# Altium schematic sheet Connector_Sheet.SchDoc
size 420 x 297 mm; SheetNumber: 8; SheetTotal: 32
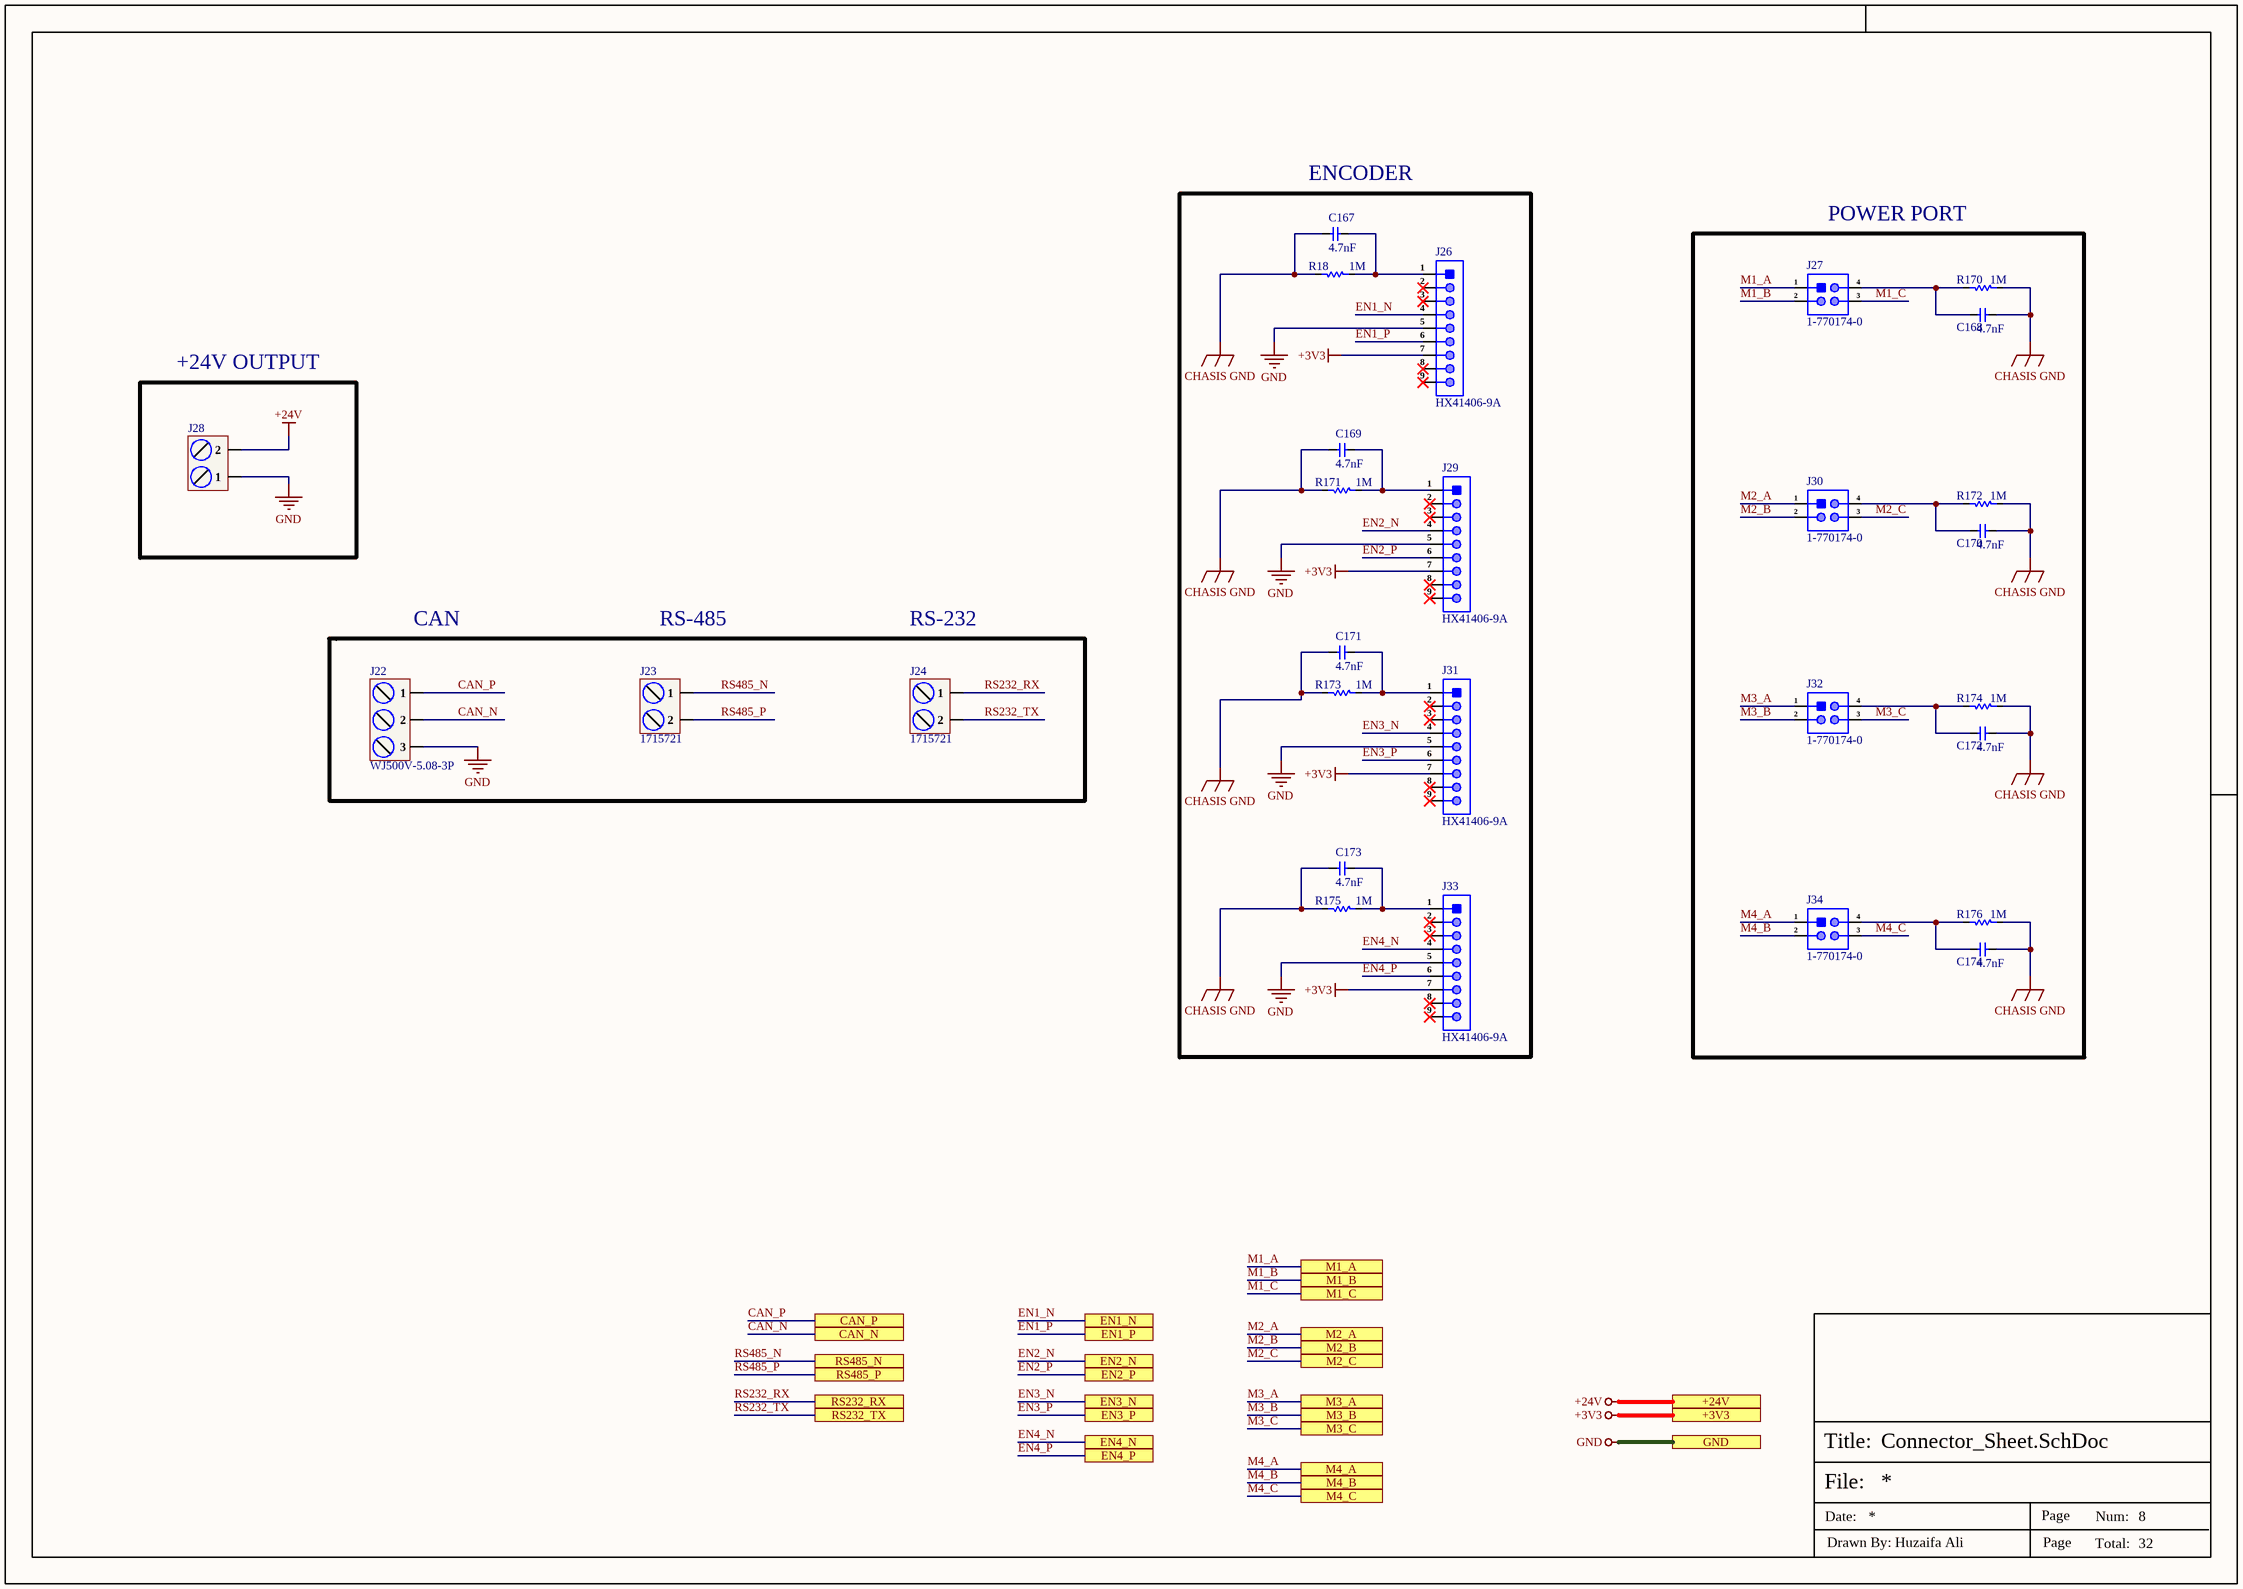
[diagram p0: Connector_Sheet.SchDoc]

## Parts
C167  4.7nF  [Cap-0603]
C168  4.7nF  [Cap-0603]
C169  4.7nF  [Cap-0603]
C170  4.7nF  [Cap-0603]
C171  4.7nF  [Cap-0603]
C172  4.7nF  [Cap-0603]
C173  4.7nF  [Cap-0603]
C174  4.7nF  [Cap-0603]
J22  WJ500V-5.08-3P  [WJ500V-5.08-3P]
J23  1715721  [1715721]
J24  1715721  [1715721]
J26  HX41406-9A  [HX41406-9A]
J27  1-770174-0  [1-770174-0]
J28  MXHB9500-9.5-02P-BK01-Cu-S-A  [MXHB9500-9.5-02P-BK01-Cu-S-A]  (value not drawn)
J29  HX41406-9A  [HX41406-9A]
J30  1-770174-0  [1-770174-0]
J31  HX41406-9A  [HX41406-9A]
J32  1-770174-0  [1-770174-0]
J33  HX41406-9A  [HX41406-9A]
J34  1-770174-0  [1-770174-0]
R18  1M  [Res-0402]
R170  1M  [Res-0402]
R171  1M  [Res-0402]
R172  1M  [Res-0402]
R173  1M  [Res-0402]
R174  1M  [Res-0402]
R175  1M  [Res-0402]
R176  1M  [Res-0402]

## Blocks framed on the sheet
ENCODER: C167 C169 C171 C173 J26 J29 J31 J33 R18 R171 R173 R175
POWER PORT: C168 C170 C172 C174 J27 J30 J32 J34 R170 R172 R174 R176

## Ports
+3V3 (see Top_Sheet[1A], CAN_Sheet[5D], Controller_Sheet[5D], Encoder_Sheet1[5D], Encoder_Sheet2[5D], Encoder_Sheet3[5D], Encoder_Sheet4[5D], EtherCAT_Sheet[5D], Motor_Driver_Sheet1[5D], Motor_Driver_Sheet2[5D], Motor_Driver_Sheet3[5D], Motor_Driver_Sheet4[5D], Power_Sheet[5D], RJ45_Sheet[5D], RS485_RS232_Sheet[3D], Sec_Controller_Sheet1[5D], Sec_Controller_Sheet2[5D], Sec_Controller_Sheet3[5D], Sec_Controller_Sheet4[5D]), +24V (see Top_Sheet[1A], DIO_1[5D], DIO_2[5D], DIO_3[5D], DIO_4[5D], MOSFET_Driver_Sheet1[5D], MOSFET_Driver_Sheet2[5D], MOSFET_Driver_Sheet3[5D], MOSFET_Driver_Sheet4[5D], Motor_Driver_Sheet1[5D], Motor_Driver_Sheet2[5D], Motor_Driver_Sheet3[5D], Motor_Driver_Sheet4[5D], Power_Sheet[5D]), CAN_N, CAN_P, EN1_N (see Top_Sheet[2B], Encoder_Sheet1[2D], Servo1[3D]), EN1_P (see Top_Sheet[2B], Encoder_Sheet1[2D], Servo1[3C]), EN2_N (see Top_Sheet[2B], Encoder_Sheet2[2D], Servo2[2D]), EN2_P (see Top_Sheet[2B], Encoder_Sheet2[2D], Servo2[2C]), EN3_N (see Top_Sheet[2B], Encoder_Sheet3[2D], Servo3[2D]), EN3_P (see Top_Sheet[2B], Encoder_Sheet3[2D], Servo3[2C]), EN4_N (see Top_Sheet[2B], Encoder_Sheet4[2D], Servo4[2D]), EN4_P (see Top_Sheet[2B], Encoder_Sheet4[2D], Servo4[2C]), GND (see Top_Sheet[1A], CAN_Sheet[5D], Controller_Sheet[5D], DIO_1[5D], DIO_2[5D], DIO_3[5D], DIO_4[5D], Encoder_Sheet1[5D], Encoder_Sheet2[5D], Encoder_Sheet3[5D], Encoder_Sheet4[5D], EtherCAT_Sheet[5D], MOSFET_Driver_Sheet1[5D], MOSFET_Driver_Sheet2[5D], MOSFET_Driver_Sheet3[5D], MOSFET_Driver_Sheet4[5D], Motor_Driver_Sheet1[5D], Motor_Driver_Sheet2[5D], Motor_Driver_Sheet3[5D], Motor_Driver_Sheet4[5D], Power_Sheet[5D], RJ45_Sheet[5D], RS485_RS232_Sheet[3D], Sec_Controller_Sheet1[5D], Sec_Controller_Sheet2[5D], Sec_Controller_Sheet3[5D], Sec_Controller_Sheet4[5D]), M1_A (see Top_Sheet[1B], MOSFET_Driver_Sheet1[4D], Servo1[5B]), M1_B (see Top_Sheet[1B], MOSFET_Driver_Sheet1[4D], Servo1[5B]), M1_C (see Top_Sheet[1B], MOSFET_Driver_Sheet1[4D], Servo1[5B]), M2_A (see Top_Sheet[1B], MOSFET_Driver_Sheet2[3D], Servo2[5B]), M2_B (see Top_Sheet[1B], MOSFET_Driver_Sheet2[3D], Servo2[5B]), M2_C (see Top_Sheet[1B], MOSFET_Driver_Sheet2[3D], Servo2[5B]), M3_A (see Top_Sheet[1B], MOSFET_Driver_Sheet3[3D], Servo3[5B]), M3_B (see Top_Sheet[1B], MOSFET_Driver_Sheet3[3D], Servo3[5B]), M3_C (see Top_Sheet[1B], MOSFET_Driver_Sheet3[3D], Servo3[5B]), M4_A (see Top_Sheet[1B], MOSFET_Driver_Sheet4[3D], Servo4[5B]), M4_B (see Top_Sheet[1B], MOSFET_Driver_Sheet4[3D], Servo4[5B]), M4_C (see Top_Sheet[1B], MOSFET_Driver_Sheet4[3D], Servo4[5B]), RS232_RX (see Top_Sheet[1A], RS485_RS232_Sheet[5D]), RS232_TX (see Top_Sheet[1A], RS485_RS232_Sheet[5D]), RS485_N (see Top_Sheet[1A], RS485_RS232_Sheet[5D]), RS485_P (see Top_Sheet[1A], RS485_RS232_Sheet[5D])

## Nets
+3V3: J26.7 J29.7 J31.7 J33.7 ; port +3V3
+24V: J28.2 ; port +24V
CHASIS GND: C167.2 C168.2 C169.2 C170.2 C171.2 C172.2 C173.2 C174.2 R18.1 R170.2 R171.1 R172.2 R173.1 R174.2 R175.1 R176.2
GND: J22.3 J26.5 J28.1 J29.5 J31.5 J33.5 ; port GND
CAN_N: J22.2 ; port CAN_N
CAN_P: J22.1 ; port CAN_P
EN1_N: J26.4 ; port EN1_N
EN1_P: J26.6 ; port EN1_P
EN2_N: J29.4 ; port EN2_N
EN2_P: J29.6 ; port EN2_P
EN3_N: J31.4 ; port EN3_N
EN3_P: J31.6 ; port EN3_P
EN4_N: J33.4 ; port EN4_N
EN4_P: J33.6 ; port EN4_P
M1_A: J27.1 ; port M1_A
M1_B: J27.2 ; port M1_B
M1_C: J27.3 ; port M1_C
M2_A: J30.1 ; port M2_A
M2_B: J30.2 ; port M2_B
M2_C: J30.3 ; port M2_C
M3_A: J32.1 ; port M3_A
M3_B: J32.2 ; port M3_B
M3_C: J32.3 ; port M3_C
M4_A: J34.1 ; port M4_A
M4_B: J34.2 ; port M4_B
M4_C: J34.3 ; port M4_C
RS232_RX: J24.1 ; port RS232_RX
RS232_TX: J24.2 ; port RS232_TX
RS485_N: J23.1 ; port RS485_N
RS485_P: J23.2 ; port RS485_P
NetC167_1: C167.1 J26.1 R18.2
NetC168_1: C168.1 J27.4 R170.1
NetC169_1: C169.1 J29.1 R171.2
NetC170_1: C170.1 J30.4 R172.1
NetC171_1: C171.1 J31.1 R173.2
NetC172_1: C172.1 J32.4 R174.1
NetC173_1: C173.1 J33.1 R175.2
NetC174_1: C174.1 J34.4 R176.1

Not connected (* = marked no-connect by the designer): J26 2* 3* 8* 9*; J29 2* 3* 8* 9*; J31 2* 3* 8* 9*; J33 2* 3* 8* 9*

## Notes on the sheet
- +24V OUTPUT
- CAN
- RS-485
- RS-232
- File:
- Title:
- Date:
- Page
- Num:
- Total:
- Drawn By: Huzaifa Ali

## Library data of the parts
C167-C174 = CC0603JRNPO9BN472: CAP CER 4700PF 50V C0G/NPO 0603; Manufacturer: Yageo; Item Type: Capacitor; Supplier 1: Digi-Key; Manufacturer Part Number: CC0603JRNPO9BN472; RoHS: Yes; Category: Ceramic Capacitors; Stock 1: 31779; Pricing 1: 1=0.48000, 10=0.33000, 50=0.23100, 100=0.19800, 500=0.14854, 1000=0.12543 (USD); RoHS Compliant: Yes; Supplier Part Number 1: 13-CC0603JRNPO9BN472CT-ND; LCSC Part Number: C576818; ComponentLink1Description: LCSC; ComponentLink1URL: https://www.lcsc.com/product-detail/Multilayer-Ceramic-Capacitors-MLCC-SMD-SMT_YAGEO-CC0603JRNPO9BN472_C576818.html
J22 = WJ500V-5.08-3P: 1x3P 18A -40℃~+105℃ 250V Green 14~30 Straight pin 5.08mm 2.5 1 3 Plugin,P=5.08mm Screw terminal ROHS; Manufacturer: Ningbo Kangnex Elec; Item Type: Terminal Block; Manufacturer Part Number: WJ500V-5.08-3P; Package: Plugin,P=5.08mm; LCSC Part Number: C72334; ComponentLink1Description: LCSC; ComponentLink1URL: https://www.lcsc.com/product-detail/Screw-terminal_Ningbo-Kangnex-Elec-WJ500V-5-08-3P_C72334.html
J23 J24 = 1715721: TERM BLK 2P SIDE ENT 5.08MM PCB; Manufacturer: Phoenix Contact; Item Type: Terminal Blocks; Supplier: Digikey; Supplier Part Number: 277-1263-ND; Manufacturer Part Number: 1715721; RoHS: Yes; Stock: 13160; Pricing: 1=0.94 (USD); ComponentLink1URL: https://datasheet.ciiva.com/1120/1697161-1120393.pdf?src-supplier=Farnell; ComponentLink1Description: https://datasheet.ciiva.com/1120/1697161-1120393.pdf?src-supplier=Farnell; ComponentLink2URL: https://datasheet.ciiva.com/832/1715721-832095.pdf?src-supplier=Digikey; ComponentLink2Description: https://datasheet.ciiva.com/832/1715721-832095.pdf?src-supplier=Digikey; ComponentLink3URL: https://datasheet.ciiva.com/15169/getdatasheetpartid-212174-15169929.pdf?src-supplier=Verical; ComponentLink3Description: https://datasheet.ciiva.com/15169/getdatasheetpartid-212174-15169929.pdf?src-supplier=Verical; ComponentLink4URL: https://datasheet.ciiva.com/16046/1715721-16046034.pdf?src-supplier=Onlinecomponents.com; ComponentLink4Description: https://datasheet.ciiva.com/16046/1715721-16046034.pdf?src-supplier=Onlinecomponents.com
J26 J29 J31 J33 = HX41406-9A: 3x3P 9P 3 4.14mm 4.14mm 3 -25℃~+105℃ 8A Straight Plugin,P=4.14mm Wire To Board Connector ROHS; Manufacturer: HX(Zhejiang Yueqing Hongxing Elec); Manufacturer Part Number: HX41406-9A; Package: Plugin,P=4.14mm; LCSC Part Number: C704507; Item Type: Wire To Board Connector; ComponentLink1Description: LCSC; ComponentLink1URL: https://www.lcsc.com/product-detail/Wire-To-Board-Connector_HX-Zhejiang-Yueqing-Hongxing-Elec-HX41406-9A_C704507.html
J27 J30 J32 J34 = 1-770174-0: CONN HEADER VERT 4POS 4.14MM; Manufacturer: TE Connectivity; Item Type: Power Connectors; Supplier: Future Electronics; Supplier Part Number: 3310547; Manufacturer Part Number: 1-770174-0; RoHS: Yes; Stock: 890; Pricing: 1=0.995, 30=1.04, 40=0.945, 125=0.91, 300=0.95, 400=0.87, 1250=0.8 (USD); ComponentLink1URL: https://datasheet.ciiva.com/19460/746478-19460823.pdf?src-supplier=Jameco; ComponentLink1Description: https://datasheet.ciiva.com/19460/746478-19460823.pdf?src-supplier=Jameco; ComponentLink2URL: https://datasheet.ciiva.com/11755/0900766b80b8608c-11755178.pdf?src-supplier=Rs; ComponentLink2Description: https://datasheet.ciiva.com/11755/0900766b80b8608c-11755178.pdf?src-supplier=Rs; ComponentLink3URL: https://datasheet.ciiva.com/16324/eng-cs-82181-softshell-high-density-0508-16324224.pdf?src-supplier=Future+Electronics; ComponentLink3Description: https://datasheet.ciiva.com/16324/eng-cs-82181-softshell-high-density-0508-16324224.pdf?src-supplier=Future+Electronics; ComponentLink4URL: https://datasheet.ciiva.com/1111/eng-cd-770174-l2-1111782.pdf?src-supplier=Element14; ComponentLink4Description: https://datasheet.ciiva.com/1111/eng-cd-770174-l2-1111782.pdf?src-supplier=Element14; ComponentLink5URL: https://datasheet.ciiva.com/15173/getdatasheetpartid-47574-15173655.pdf?src-supplier=Verical; ComponentLink5Description: https://datasheet.ciiva.com/15173/getdatasheetpartid-47574-15173655.pdf?src-supplier=Verical; ComponentLink6URL: https://datasheet.ciiva.com/710/eng-cd-770174-m-710026.pdf?src-supplier=Digikey; ComponentLink6Description: https://datasheet.ciiva.com/710/eng-cd-770174-m-710026.pdf?src-supplier=Digikey; ComponentLink7URL: https://datasheet.ciiva.com/3126/eng-cs-82181-softshell-high-density-0408-3126092.pdf?src-supplier=Avnet; ComponentLink7Description: https://datasheet.ciiva.com/3126/eng-cs-82181-softshell-high-density-0408-3126092.pdf?src-supplier=Avnet; ComponentLink8URL: https://datasheet.ciiva.com/30189/eng-cs-82181-softshell-high-density-0508-30189644.pdf?src-supplier=Onlinecomponents.com; ComponentLink8Description: https://datasheet.ciiva.com/30189/eng-cs-82181-softshell-high-density-0508-30189644.pdf?src-supplier=Onlinecomponents.com; ComponentLink9URL: https://datasheet.ciiva.com/29266/745091-da-01-en-4-pol-mini-univ-mate-n-lok-stecksockel-29266107.pdf?src-supplier=Conrad; ComponentLink9Description: https://datasheet.ciiva.com/29266/745091-da-01-en-4-pol-mini-univ-mate-n-lok-stecksockel-29266107.pdf?src-supplier=Conrad
J28 = MXHB9500-9.5-02P-BK01-Cu-S-A: Tin 1x2P Corner pin Three sides 2 1 9.5mm -40℃~+105℃ 20A 300V Black 10~22 Copper Alloy 0.5~4 Plugin,P=9.5mm Barrier Terminal Blocks ROHS; Manufacturer: MAX; Manufacturer Part Number: MXHB9500-9.5-02P-BK01-Cu-S-A; Package: Plugin,P=9.5mm; LCSC Part Number: C7542168; Item Type: Terminal Block; ComponentLink1Description: LCSC; ComponentLink1URL: https://www.lcsc.com/product-detail/Barrier-Terminal-Blocks_MAX-MXHB9500-9-5-02P-BK01-Cu-S-A_C7542168.html
R18 R170-R176 = AF0402JR-071ML: RES SMD 1M OHM 5% 1/16W 0402; Manufacturer: Yageo; Resistance: 1MR; Max Power Dissipation: 63mW; Temperature Coefficient: 100ppm/°C; Item Type: Resistor; Supplier 1: Digi-Key; Manufacturer Part Number: AF0402JR-071ML; Stock 1: 0; Pricing 1: 10000=0.00408 (USD); Case/Package: 0402; Min Operating Temperature: -55°C; Max Operating Temperature: 155°C; Packaging: Tape and Reel; Resistor Type: Thick Film; Number of Terminations: 2; Tolerance: 5%; Features: Moisture Resistant,Anti-Sulfur; Length: 0.039inch; Width: 0.02inch; Height: 0.015inch; RoHS Compliant: Yes; ComponentLink1URL: https://www.yageo.com/upload/media/product/productsearch/datasheet/rchip/PYu-AF_51_RoHS_L_6.pdf?src-supplier=Digi-Key; ComponentLink1Description: https://www.yageo.com/upload/media/product/productsearch/datasheet/rchip/PYu-AF_51_RoHS_L_6.pdf?src-supplier=Digi-Key; Supplier Part Number 1: AF0402JR-071ML-ND; LCSC Part Number: C144054